# Altium schematic sheet soc-pwr.schdoc: SOC-PWR
size A4; Date: 09.27.2026; CheckedBy: BCY; DrawnBy: miaow; Revision: v1.0.0; SheetNumber: 4; SheetTotal: 17; BoardType: MAIN_PCB; Desc: Power supply of the H618
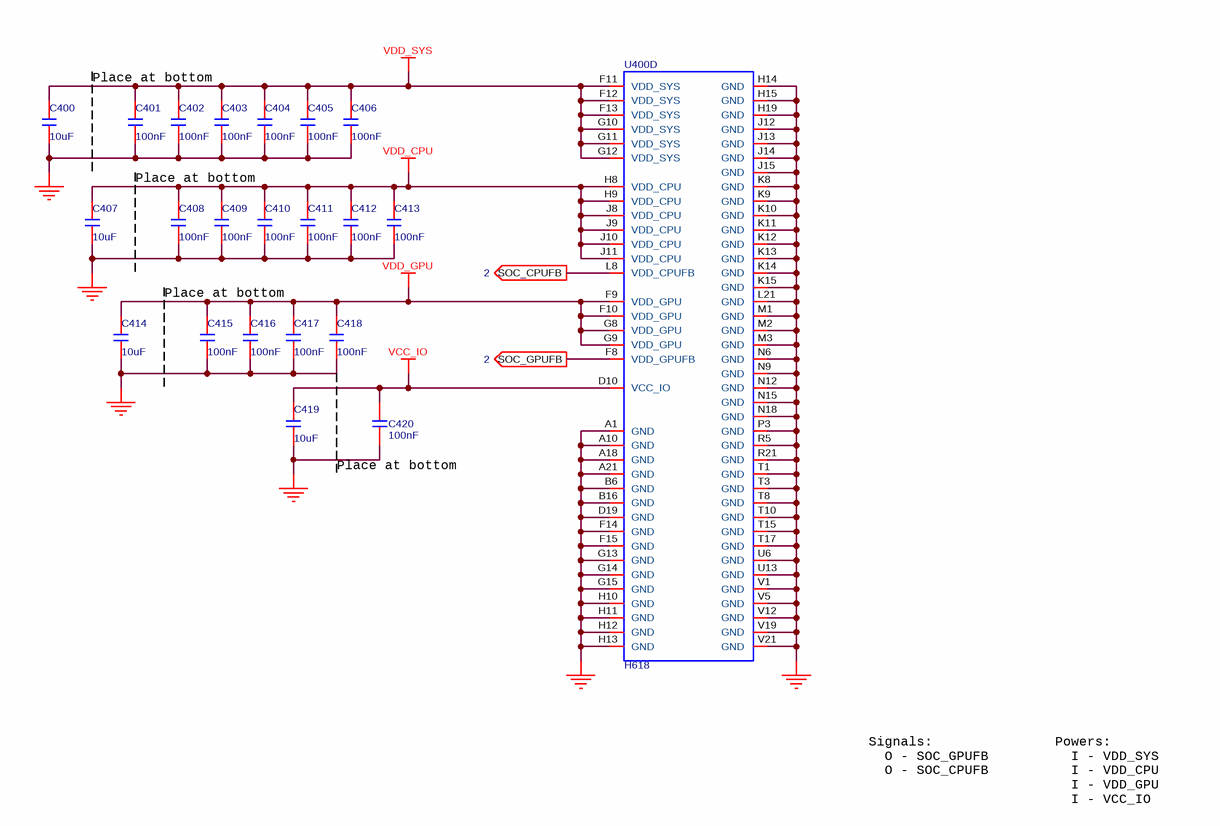
[diagram p0: soc-pwr.schdoc]

## Parts
C400  value 10uF  [C0402]  (hidden comment: C-NOMO)
C401  value 100nF  [C0201]  (hidden comment: C-NOMO)
C402  value 100nF  [C0201]  (hidden comment: C-NOMO)
C403  value 100nF  [C0201]  (hidden comment: C-NOMO)
C404  value 100nF  [C0201]  (hidden comment: C-NOMO)
C405  value 100nF  [C0201]  (hidden comment: C-NOMO)
C406  value 100nF  [C0201]  (hidden comment: C-NOMO)
C407  value 10uF  [C0402]  (hidden comment: C-NOMO)
C408  value 100nF  [C0201]  (hidden comment: C-NOMO)
C409  value 100nF  [C0201]  (hidden comment: C-NOMO)
C410  value 100nF  [C0201]  (hidden comment: C-NOMO)
C411  value 100nF  [C0201]  (hidden comment: C-NOMO)
C412  value 100nF  [C0201]  (hidden comment: C-NOMO)
C413  value 100nF  [C0201]  (hidden comment: C-NOMO)
C414  value 10uF  [C0402]  (hidden comment: C-NOMO)
C415  value 100nF  [C0201]  (hidden comment: C-NOMO)
C416  value 100nF  [C0201]  (hidden comment: C-NOMO)
C417  value 100nF  [C0201]  (hidden comment: C-NOMO)
C418  value 100nF  [C0201]  (hidden comment: C-NOMO)
C419  value 10uF  [C0402]  (hidden comment: C-NOMO)
C420  value 100nF  [C0201]  (hidden comment: C-NOMO)
U400  H618  [H618]  (part D of 4)

## Ports
SOC_CPUFB (out, see 2), SOC_GPUFB (out, see 2)

## Nets
GND: C400.1 C401.1 C402.1 C403.1 C404.1 C405.1 C406.1 C407.1 C408.1 C409.1 C410.1 C411.1 C412.1 C413.1 C414.1 C415.1 C416.1 C417.1 C418.1 C419.1 C420.1 U400.A1(GND) U400.A10(GND) U400.A18(GND) U400.A21(GND) U400.B6(GND) U400.B16(GND) U400.D19(GND) U400.F14(GND) U400.F15(GND) U400.G13(GND) U400.G14(GND) U400.G15(GND) U400.H10(GND) U400.H11(GND) U400.H12(GND) U400.H13(GND) U400.H14(GND) U400.H15(GND) U400.H19(GND) U400.J12(GND) U400.J13(GND) U400.J14(GND) U400.J15(GND) U400.K8(GND) U400.K9(GND) U400.K10(GND) U400.K11(GND) U400.K12(GND) U400.K13(GND) U400.K14(GND) U400.K15(GND) U400.L21(GND) U400.M1(GND) U400.M2(GND) U400.M3(GND) U400.N6(GND) U400.N9(GND) U400.N12(GND) U400.N15(GND) U400.N18(GND) U400.P3(GND) U400.R5(GND) U400.R21(GND) U400.T1(GND) U400.T3(GND) U400.T8(GND) U400.T10(GND) U400.T15(GND) U400.T17(GND) U400.U6(GND) U400.U13(GND) U400.V1(GND) U400.V5(GND) U400.V12(GND) U400.V19(GND) U400.V21(GND)
VCC_IO: C419.2 C420.2 U400.D10(VCC_IO)
VDD_CPU: C407.2 C408.2 C409.2 C410.2 C411.2 C412.2 C413.2 U400.H8(VDD_CPU) U400.H9(VDD_CPU) U400.J8(VDD_CPU) U400.J9(VDD_CPU) U400.J10(VDD_CPU) U400.J11(VDD_CPU)
VDD_GPU: C414.2 C415.2 C416.2 C417.2 C418.2 U400.F9(VDD_GPU) U400.F10(VDD_GPU) U400.G8(VDD_GPU) U400.G9(VDD_GPU)
VDD_SYS: C400.2 C401.2 C402.2 C403.2 C404.2 C405.2 C406.2 U400.F11(VDD_SYS) U400.F12(VDD_SYS) U400.F13(VDD_SYS) U400.G10(VDD_SYS) U400.G11(VDD_SYS) U400.G12(VDD_SYS)
SOC_CPUFB: U400.L8(VDD_CPUFB) ; port SOC_CPUFB
SOC_GPUFB: U400.F8(VDD_GPUFB) ; port SOC_GPUFB

## Notes on the sheet
- Place at bottom
- (near C420) Place at bottom
- Signals:
  O - SOC_GPUFB
  O - SOC_CPUFB
- Powers:
  I - VDD_SYS
  I - VDD_CPU
  I - VDD_GPU
  I - VCC_IO
- DRAWN
- CHECKED
- DRAWNBY
- SHEETS
- SHEETS_NO

## Library data of the parts
C400 C407 C414 C419 = C-NOMO: voltage: 6.3V; precision: 20%; Supplier 1: LCSC; Supplier Part Number 1: C15525
C401-C406 C408-C413 C415-C418 C420 = C-NOMO: voltage: 10V; precision: 10%; Supplier 1: LCSC; Supplier Part Number 1: C49062
U400 = H618: SOC; Supplier 1: LCSC; Supplier Part Number 1: C19189292